# Altium schematic sheet TopLevel.SchDoc
size 508 x 304 mm; DrawnBy: Constanza Barriga; SheetNumber: 1; SheetTotal: 10
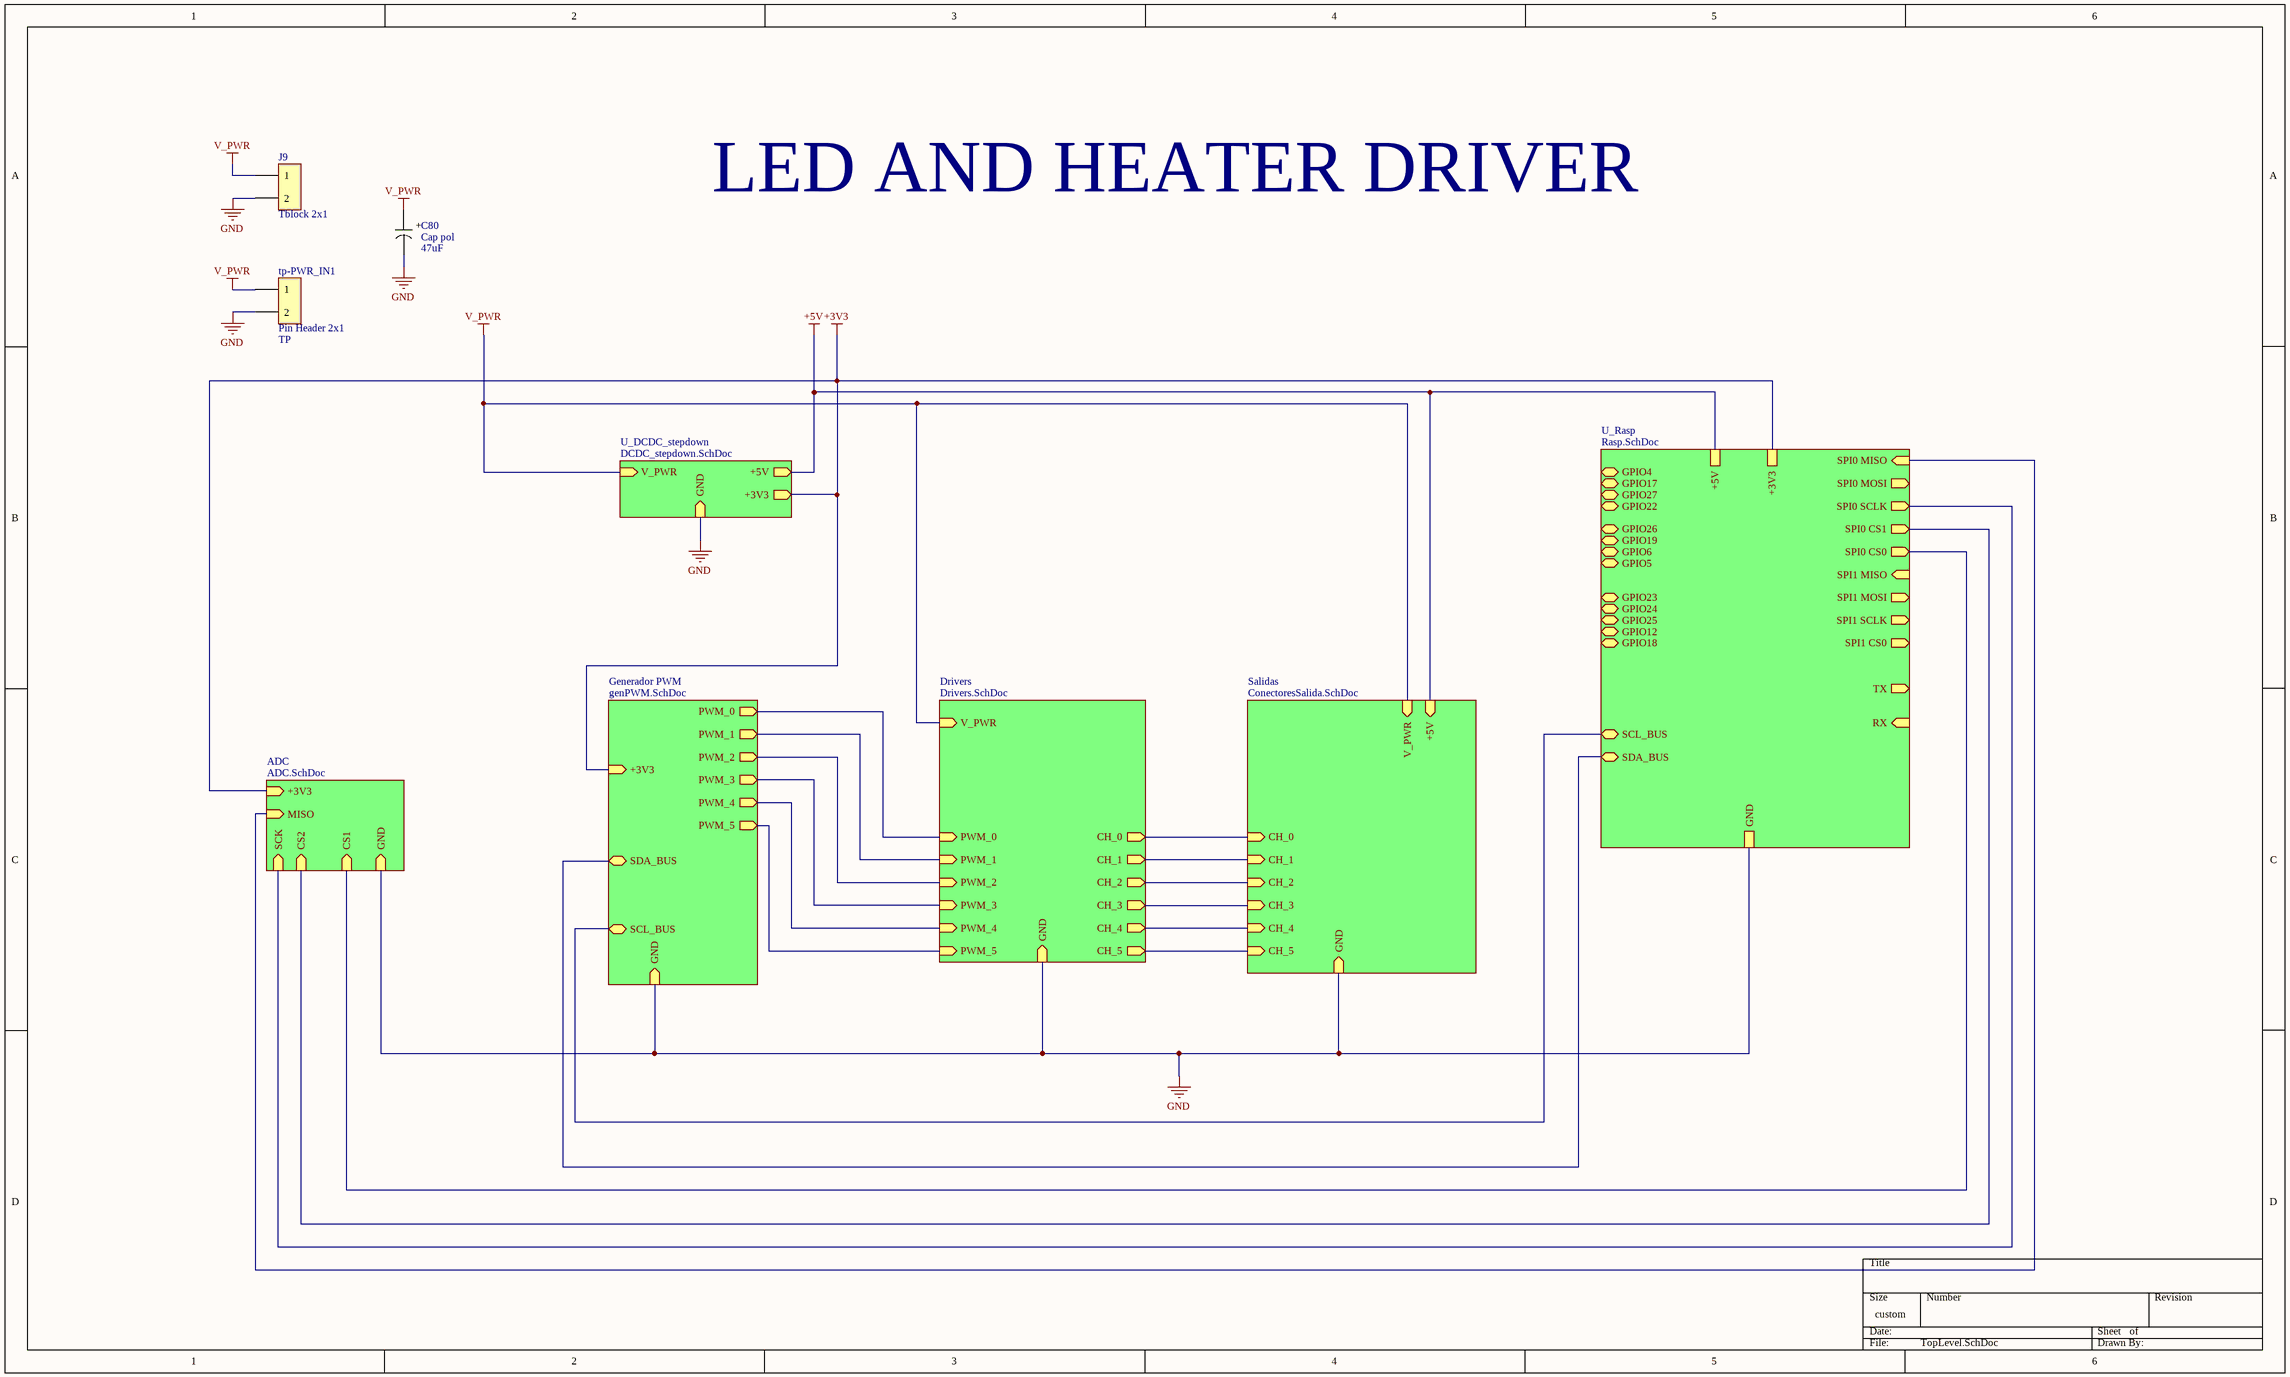
[diagram p0: TopLevel.SchDoc]

## Parts
C80  Cap pol  value 47uF  [CAP_SMD_Electrolytic_5X5.4]
J9  Tblock 2x1  [T_BLOCK_2P]
tp-PWR_IN1  Pin Header 2x1  [HDR-TH_P2.54-H-M_A2541WV-2P]

## Sub-sheets
ADC = ADC.SchDoc: +3V3 (in), GND (in), SCK (in), CS2 (in), MISO (in), CS1 (in)
Drivers = Drivers.SchDoc: GND (in), PWM_4 (in), PWM_3 (in), PWM_2 (in), PWM_1 (in), PWM_0 (in), V_PWR (in), CH_0 (out), CH_1 (out), CH_2 (out), CH_3 (out), CH_4 (out), CH_5 (out), PWM_5 (in)
Generador PWM = genPWM.SchDoc: PWM_0 (out), PWM_1 (out), PWM_2 (out), PWM_3 (out), PWM_4 (out), +3V3 (in), SDA_BUS (bidir), SCL_BUS (bidir), GND (in), PWM_5 (out)
Salidas = ConectoresSalida.SchDoc: V_PWR (in), +5V (in), CH_0 (in), CH_1 (in), CH_2 (in), CH_3 (in), CH_4 (in), GND (in), CH_5 (in)
U_DCDC_stepdown = DCDC_stepdown.SchDoc: V_PWR (in), GND (in), +5V (out), +3V3 (out)
U_Rasp = Rasp.SchDoc: GPIO4 (bidir), GPIO17 (bidir), GPIO27 (bidir), GPIO22 (bidir), SPI0 MOSI (out), SPI0 MISO (in), SPI0 SCLK (out), GPIO26 (bidir), GPIO19 (bidir), GPIO6 (bidir), GPIO5 (bidir), SPI1 MISO (in), SPI1 MOSI (out), SPI0 CS1 (out), SPI1 SCLK (out), SPI0 CS0 (out), RX (in), TX (out), GPIO23 (bidir), GPIO24 (bidir), GPIO25 (bidir), GPIO12 (bidir), SPI1 CS0 (out), GPIO18 (bidir), +5V, +3V3, GND, SCL_BUS (bidir), SDA_BUS (bidir)

## Nets
+3V3: sheet Generador PWM/+3V3, sheet ADC/+3V3, sheet U_DCDC_stepdown/+3V3, sheet U_Rasp/+3V3
+5V: sheet Salidas/+5V, sheet U_DCDC_stepdown/+5V, sheet U_Rasp/+5V
GND: C80.1 J9.2 tp-PWR_IN1.2 ; sheet Generador PWM/GND, sheet Drivers/GND, sheet Salidas/GND, sheet ADC/GND, sheet U_DCDC_stepdown/GND, sheet U_Rasp/GND
V_PWR: C80.2 J9.1 tp-PWR_IN1.1 ; sheet Drivers/V_PWR, sheet Salidas/V_PWR, sheet U_DCDC_stepdown/V_PWR
(unnamed): sheet Generador PWM/PWM_0, sheet Drivers/PWM_0
(unnamed): sheet Generador PWM/PWM_1, sheet Drivers/PWM_1
(unnamed): sheet Generador PWM/PWM_2, sheet Drivers/PWM_2
(unnamed): sheet Generador PWM/PWM_3, sheet Drivers/PWM_3
(unnamed): sheet Generador PWM/PWM_4, sheet Drivers/PWM_4
(unnamed): sheet Generador PWM/SDA_BUS, sheet U_Rasp/SDA_BUS
(unnamed): sheet Generador PWM/SCL_BUS, sheet U_Rasp/SCL_BUS
(unnamed): sheet Generador PWM/PWM_5, sheet Drivers/PWM_5
(unnamed): sheet Drivers/CH_0, sheet Salidas/CH_0
(unnamed): sheet Drivers/CH_1, sheet Salidas/CH_1
(unnamed): sheet Drivers/CH_2, sheet Salidas/CH_2
(unnamed): sheet Drivers/CH_3, sheet Salidas/CH_3
(unnamed): sheet Drivers/CH_4, sheet Salidas/CH_4
(unnamed): sheet Drivers/CH_5, sheet Salidas/CH_5
(unnamed): sheet ADC/SCK, sheet U_Rasp/SPI0 SCLK
(unnamed): sheet ADC/CS2, sheet U_Rasp/SPI0 CS1
(unnamed): sheet ADC/MISO, sheet U_Rasp/SPI0 MISO
(unnamed): sheet ADC/CS1, sheet U_Rasp/SPI0 CS0

## Notes on the sheet
- LED AND HEATER DRIVER
- (near tp-PWR_IN1) TP
- (in symbol Cap pol) +

## Library data of the parts
C80 = Cap pol: Electrolytic Aluminium Capacitor; Manufacturer: *; Manufacturer Part Number: *; Supplier 1: LCSC; Supplier Part Number 1: *; Voltage: *; Package: *
J9 = Header - 2x1b: Screw terminal 2pos, 1 row, 5pitch; Manufacturer: CJT(Changjiang Connectors); Manufacturer Part Number: A2547WV-2P; Pitch: 2.54mm; Description: P=5.0mm Screw terminal ROHS; Supplier 1: LCSC; Supplier Part Number 1: C8404; Package: Through Hole,P=2.54mm
tp-PWR_IN1 = Header - 2x1c: Pin Header 2pos, 1 row, 2.54 pitch; Manufacturer: CJT(Changjiang Connectors); Manufacturer Part Number: A2541WV-2P; Pitch: 2.54; Supplier 1: LCSC; Supplier Part Number 1: C492401